# EAGLE design gps_board (EAGLE 9.6.2)
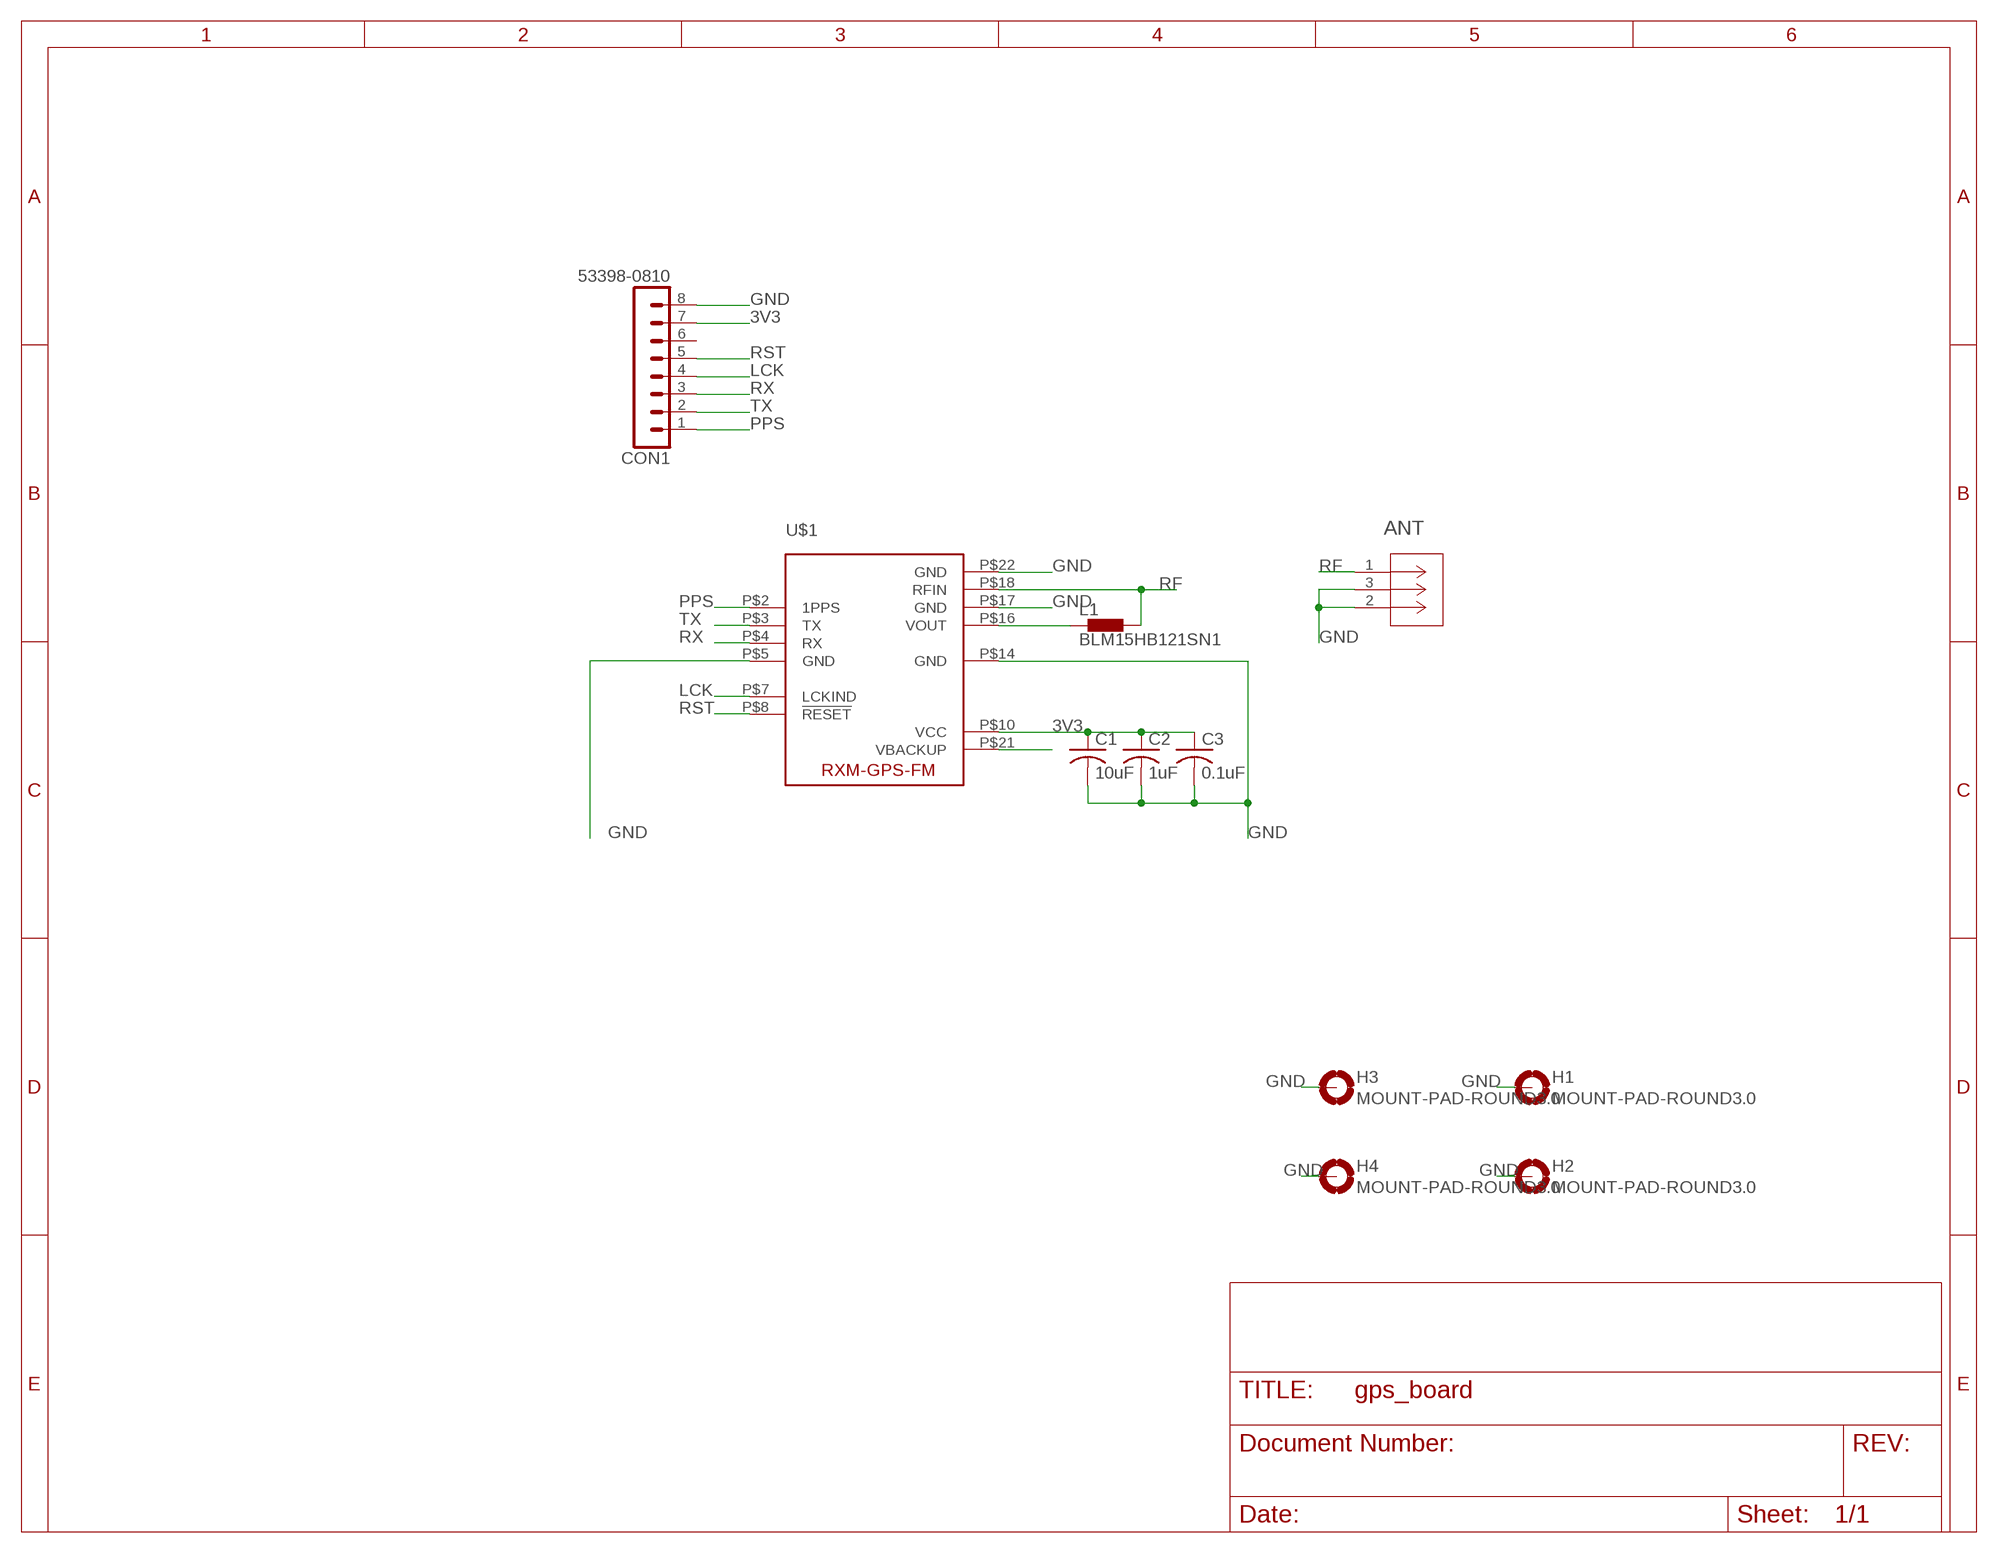
[diagram p0: schematic, sheet 1]

## Parts
ANT  U.FL-R-SMT-1(10)  [CONN_R-SMT-1(10)]
C1  10uF  C-USC0603  [C0603]
C2  1uF  C-USC0603  [C0603]
C3  0.1uF  C-USC0603  [C0603]
CON1  53398-0810  [53398-0810]
H1  MOUNT-PAD-ROUND3.0  [3,0-PAD]
H2  MOUNT-PAD-ROUND3.0  [3,0-PAD]
H3  MOUNT-PAD-ROUND3.0  [3,0-PAD]
H4  MOUNT-PAD-ROUND3.0  [3,0-PAD]
L1  BLM15HB121SN1  [0402]
U$1  RXM-GPS-FM  [RXM-GPS-FM]

## Nets
3V3: C1.1 C2.1 C3.1 CON1.7 U$1.P$10(VCC)
GND: ANT.2 ANT.3 C1.2 C2.2 C3.2 CON1.8 H1.B3,0(MOUNT) H2.B3,0(MOUNT) H3.B3,0(MOUNT) H4.B3,0(MOUNT) U$1.P$5(GND) U$1.P$14(GND) U$1.P$17(GND) U$1.P$22(GND)
LCK: CON1.4 U$1.P$7(LCKIND)
N$1: L1.1 U$1.P$16(VOUT)
N$9: U$1.P$21(VBACKUP)
PPS: CON1.1 U$1.P$2(1PPS)
RF: ANT.1 L1.2 U$1.P$18(RFIN)
RST: CON1.5 U$1.P$8(!RESET)
RX: CON1.3 U$1.P$4(RX)
TX: CON1.2 U$1.P$3(TX)
Unconnected: CON1.6

## Library data of the parts
ANT = ufl:U.FL-R-SMT-1(10); BUILT_BY: EMA_Matt; COPYRIGHT: Copyright (C) 2018 Accelerated Designs. All rights reserved; MANUFACTURER_PART_NUMBER: U.FL-R-SMT-1(10); VENDOR: Hirose
C1-C3 = rcl:C-US: CAPACITOR, American symbol; SPICEPREFIX: C
CON1 = con-molex-picoblade:53398-0810: HEADER
H1-H4 = holes:MOUNT-PAD-ROUND: MOUNTING PAD, round
L1 = inductors:BLM15H: EMIFIL (R) Chip Ferrite Bead for GHz Noise Source: http://www.murata.com/ Ferrite Bead BLM15H.pdf
U$1 = linxtechnologies:RXM-GPS-FM: RF RCVR GPS 1575.42MHZ MODULE

## Board
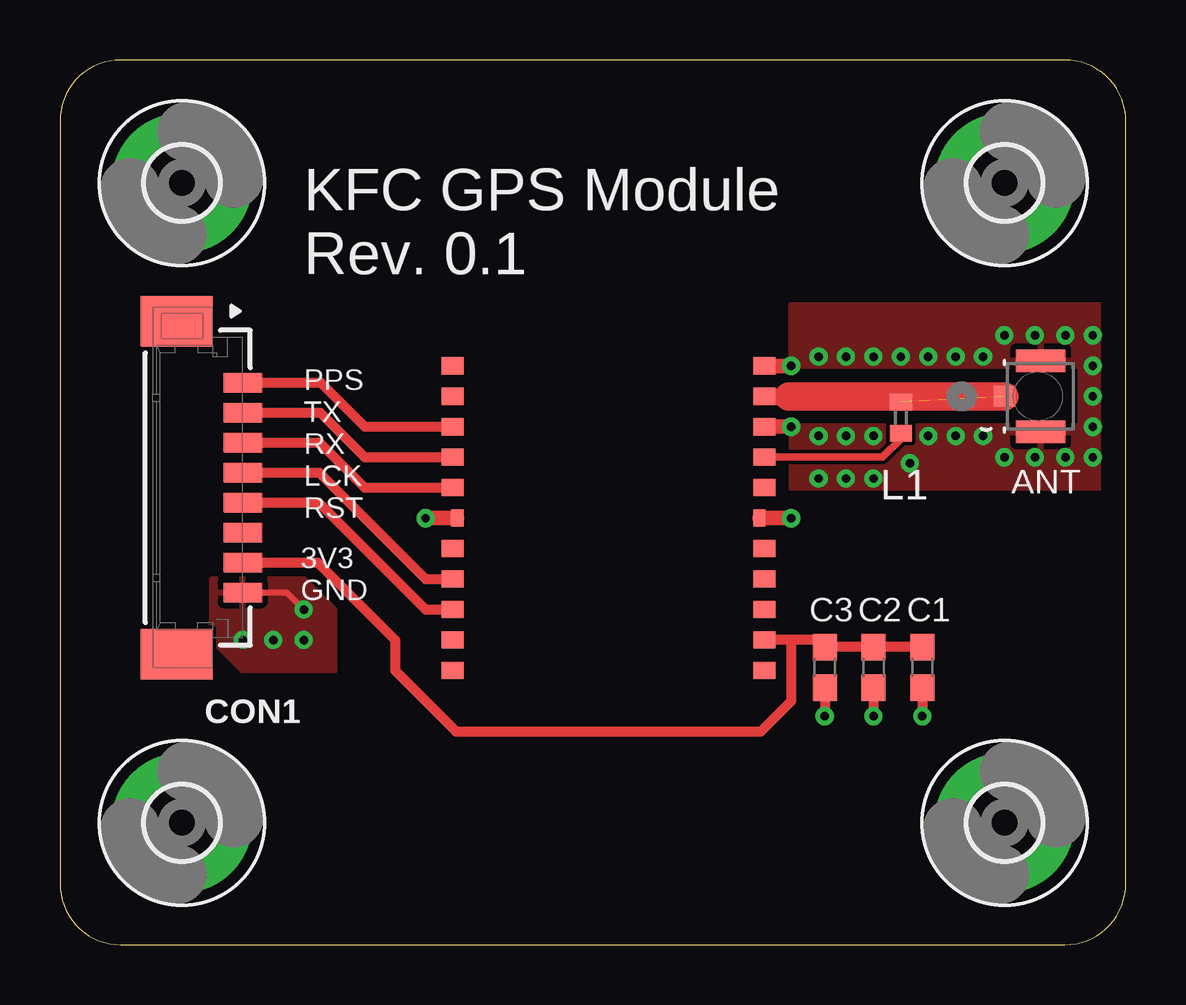
[diagram p1: board, top side]
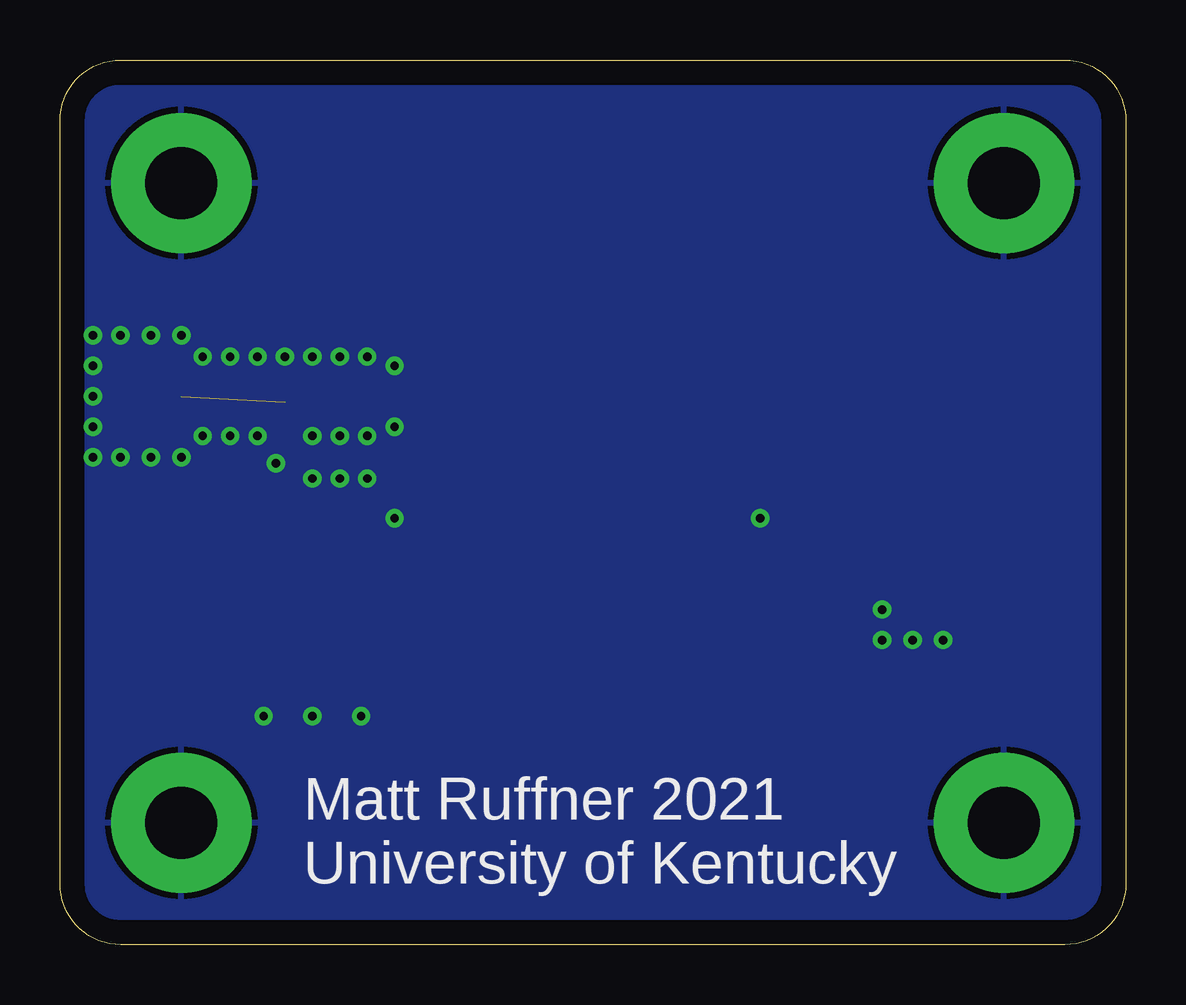
[diagram p2: board, bottom side, seen from below]

Size 44.43 x 36.88 mm. Coordinates in mm from the lower left corner, seen from the top.
Outline: 0,34.34 0,2.54 arc90 2.54,0 41.89,0 arc90 44.43,2.54 44.43,34.34 arc90 41.89,36.88 2.54,36.88 arc90 0,34.34
Copper layers (1*16): Top 0.035mm / dielectric 1.5mm / Bottom 0.035mm
Design rules "default *": minimum track width 6mil, minimum drill 0.35mm, track to track 6mil, track to pad 6mil, pad to pad 6mil, via to via 6mil, smd to smd 6mil, copper to edge 40mil, drill to drill 6mil, minimum pad ring 10mil, minimum via ring 8mil, stop-mask expansion 4mil, vias tented up to drill 14mil, thermal gap 10mil

### Footprints (pad centres in the part's own frame; a part is rotated, then mirrored left to right if it is on the bottom)
CONN_R-SMT-1(10) = smd 0.838 x 0.889: 1 0,0 | smd 0.94 x 2.057: 2 -1.48,-1.505; 3 1.48,-1.505
C0603 = smd 1.1 x 1: 1 -0.85,0; 2 0.85,0
53398-0810 = smd 0.8 x 1.6: 1 4.375,0; 2 3.125,0; 3 1.875,0; 4 0.625,0; 5 -0.625,0; 6 -1.875,0; 7 -3.125,0; 8 -4.375,0 | smd 2.1 x 3: M1 6.935,2.75; M2 -6.935,2.75
3,0-PAD = drill 3 pad 5.842: B3,0 0,0
0402 = smd 0.7 x 0.9: 1 -0.65,0; 2 0.65,0
RXM-GPS-FM = smd 0.914 x 0.711: P$1 -6.502,5.08; P$2 -6.502,3.81; P$3 -6.502,2.54; P$4 -6.502,1.27; P$6 -6.502,-1.27; P$7 -6.502,-2.54; P$8 -6.502,-3.81; P$9 -6.502,-5.08; P$10 6.502,-5.08; P$11 6.502,-3.81; P$12 6.502,-2.54; P$13 6.502,-1.27; P$15 6.502,1.27; P$16 6.502,2.54; P$17 6.502,3.81; P$18 6.502,5.08; P$19 -6.502,6.35; P$20 -6.502,-6.35; P$21 6.502,-6.35; P$22 6.502,6.35 | smd 0.508 x 0.711: P$5 -6.299,0; P$14 6.299,0

### Placement (x,y rotation side)
ANT  39.37,22.86 90 top
C1  35.94,11.56 270 top
C2  33.91,11.56 270 top
C3  31.88,11.56 270 top
CON1  7.62,19.05 90 top
H1  39.37,31.75 0 top
H2  5.08,5.08 0 top
H3  39.37,5.08 0 top
H4  5.08,31.75 0 top
L1  35.05,21.97 90 top
U$1  22.86,17.78 0 top

### Tracks (layer width: path | path; a pad name or v marks a point on that pad's centre or on a via)
3V3
  Top 0.406: CON1.7 10.74,15.93 13.97,12.7 13.97,11.43 16.51,8.89 29.21,8.89 30.48,10.16 30.48,12.7 | 30.48,12.7 U$1.P$10 | C1.1 C2.1 C3.1 31.58,12.7 30.48,12.7
GND  (via drill 0.35)
  Top 0.254: CON1.8 9.46,14.68 v10.16,13.97
  Top 0.406: C3.2 v31.88,9.53 | C2.2 v33.91,9.53 | C1.2 v35.94,9.53
  Top 0.61: U$1.P$14 v30.48,17.78 | U$1.P$5 v15.24,17.78 | U$1.P$17 v30.48,21.59 | U$1.P$22 v30.48,24.13
  other vias: 39.37,25.4 41.91,20.32 40.64,20.32 39.37,20.32 41.91,25.4 40.64,25.4 10.16,12.7 8.89,12.7 7.62,12.7 31.62,24.51 32.77,24.51 33.91,24.51 35.05,24.51 36.2,24.51 37.34,24.51 38.48,24.51 31.62,21.21 32.77,21.21 33.91,21.21 36.2,21.21 37.34,21.21 38.48,21.21 43.05,25.4 43.05,24.13 43.05,22.86 43.05,21.59 43.05,20.32 35.43,20.07 33.91,19.43 32.77,19.43 31.62,19.43
  pour Bottom: -1.27,40.64 46.99,40.64 46.99,-1.27 -1.27,-1.27
  pour Top: 44.45,26.67 44.45,21.59 42.55,21.59 42.55,24.13 30.48,24.13 30.48,26.67
  pour Top: 44.45,21.59 30.48,21.59 30.48,19.05 44.45,19.05
  pour Top: 6.35,15.24 10.16,15.24 11.43,13.97 11.43,12.7 11.43,11.43 7.62,11.43 6.35,12.7
LCK
  Top 0.406: CON1.4 10.8,19.68 15.24,15.24 U$1.P$7
N$1
  Top 0.305: U$1.P$16 34.29,20.32 35.05,21.08 L1.1
PPS
  Top 0.406: CON1.1 10.87,23.43 12.7,21.59 U$1.P$2
RF  (1 unrouted)
  Top 0.711: U$1.P$18 30.38,22.86
  Top 1.191: ANT.1 30.38,22.86
RST
  Top 0.406: CON1.5 10.79,18.43 15.24,13.97 U$1.P$8
RX
  Top 0.406: CON1.3 10.82,20.93 12.7,19.05 U$1.P$4
TX
  Top 0.406: CON1.2 10.85,22.18 12.7,20.32 U$1.P$3

### Text on the board
tNames: KFC GPS Module / Rev. 0.1 | PPS / TX / RX / LCK / RST | 3V3 / GND
bNames: Matt Ruffner 2021 / University of Kentucky